# EAGLE design Main (EAGLE 7.5.0)
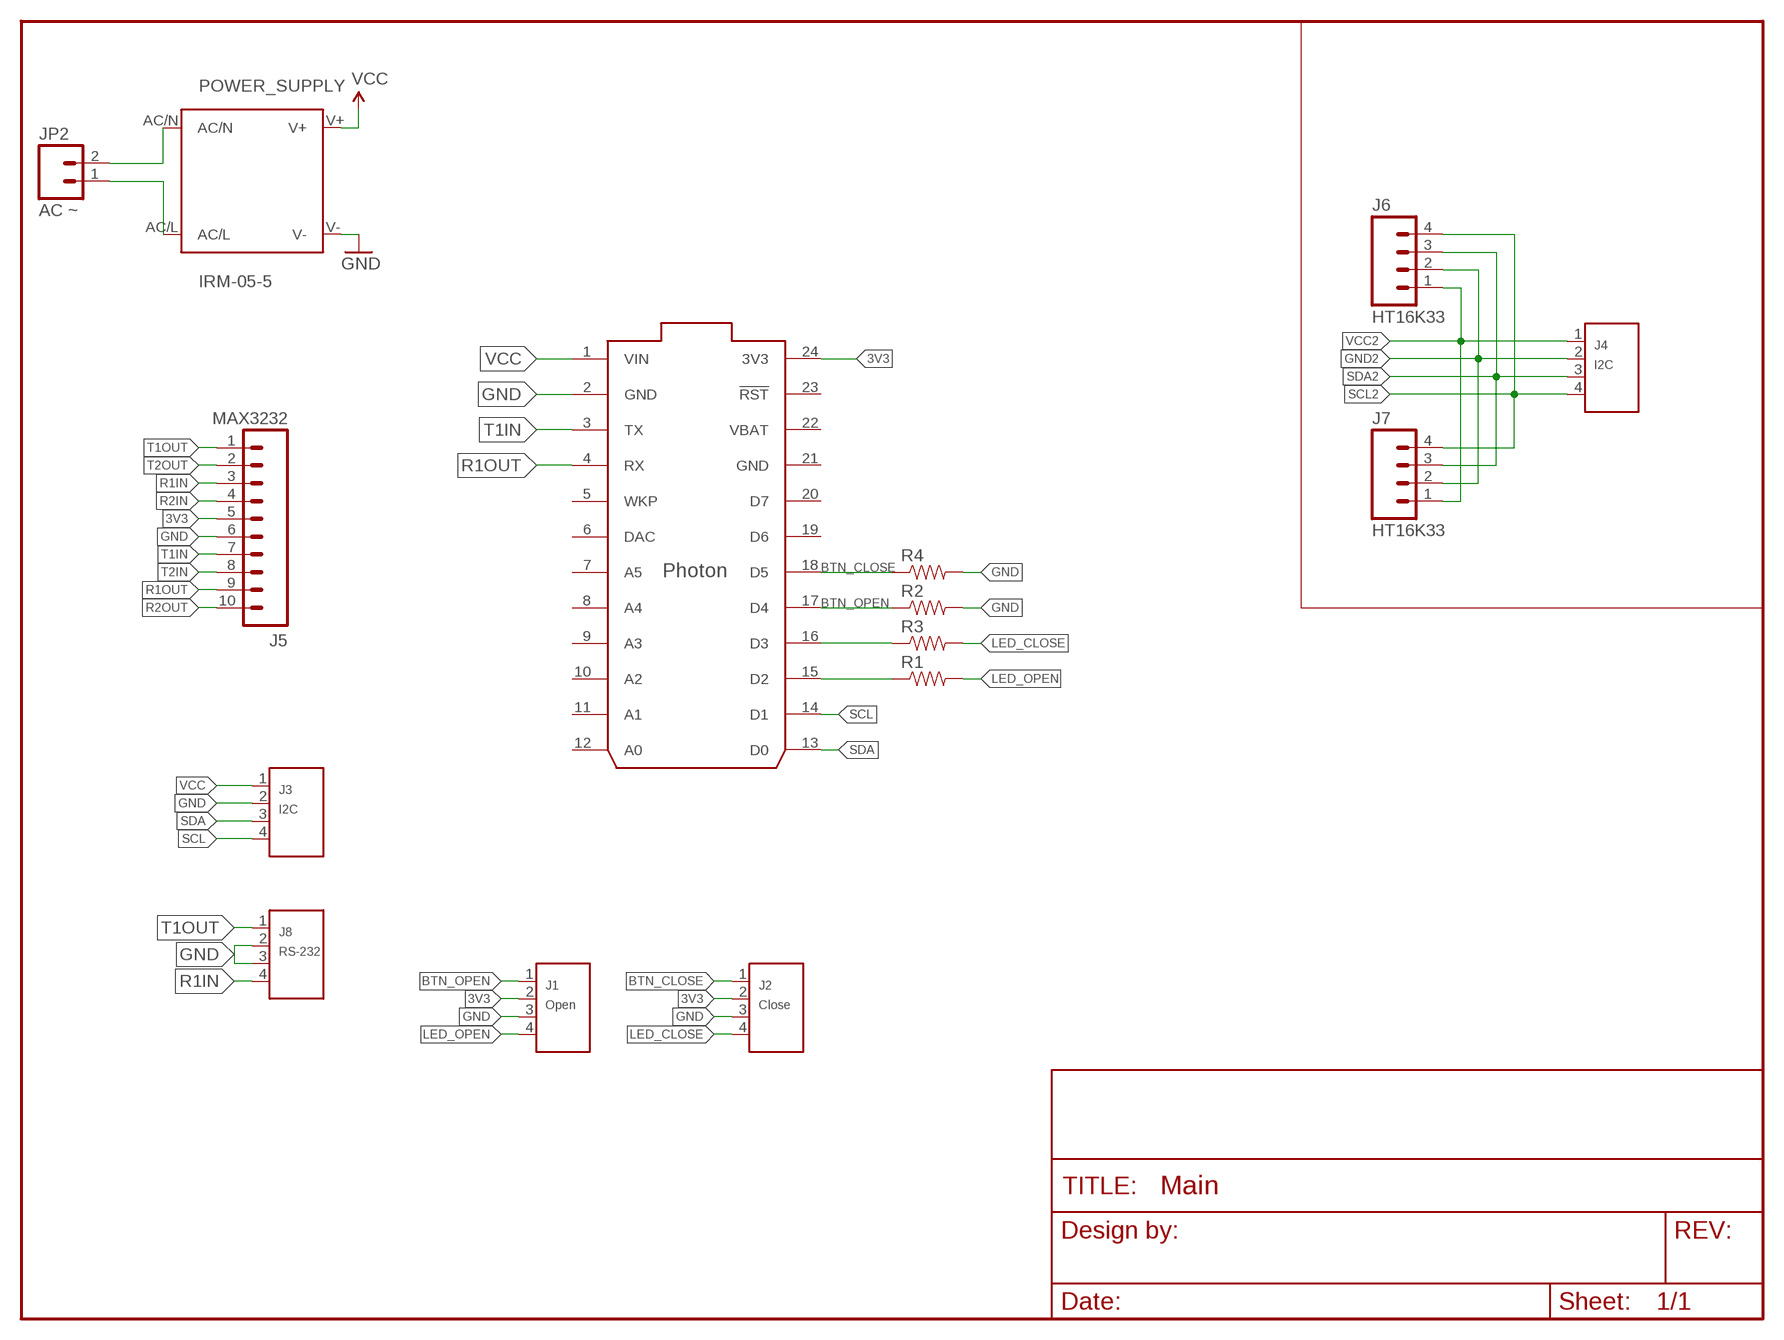
[diagram p0: schematic, sheet 1]

## Parts
J1  Open  GROVE-CONNECTOR-DIP(4P-2.0)  [HW4-2.0]
J2  Close  GROVE-CONNECTOR-DIP(4P-2.0)  [HW4-2.0]
J3  I2C  GROVE-CONNECTOR-DIP(4P-2.0)  [HW4-2.0]
J4  I2C  GROVE-CONNECTOR-DIP(4P-2.0)  [HW4-2.0]
J5  MAX3232  M10SILK_FEMALE_PTH  [1X10]
J6  HT16K33  M04PTH  [1X04]
J7  HT16K33  M04PTH  [1X04]
J8  RS-232  GROVE-CONNECTOR-DIP(4P-2.0)  [HW4-2.0]
JP2  AC ~  M025MM  [SCREWTERMINAL-5MM-2]
PHOTON  PHOTON  PHOTON_WITH_HEADERS  [PHOTON]
POWER_SUPPLY  IRM-05-5  IRM_05/10  [IRM_05/10]
R1  RESISTORPTH-1/4W  [AXIAL-0.4]
R2  RESISTORPTH-1/4W  [AXIAL-0.4]
R3  RESISTORPTH-1/4W  [AXIAL-0.4]
R4  RESISTORPTH-1/4W  [AXIAL-0.4]

## Nets
3V3: J1.2 J2.2 J5.5 PHOTON.24(3V3)
BTN_CLOSE: J2.1 PHOTON.18(D5) R4.P$1
BTN_OPEN: J1.1 PHOTON.17(D4) R2.P$1
GND: J1.3 J2.3 J3.2 J5.6 J8.2 J8.3 PHOTON.2(GND) POWER_SUPPLY.V- R2.P$2 R4.P$2
GND2: J4.2 J6.2 J7.2
LED_CLOSE: J2.4 R3.P$2
LED_OPEN: J1.4 R1.P$2
N$1: JP2.1 POWER_SUPPLY.AC/L
N$2: JP2.2 POWER_SUPPLY.AC/N
N$7: PHOTON.16(D3) R3.P$1
N$8: PHOTON.15(D2) R1.P$1
R1IN: J5.3 J8.4
R1OUT: J5.9 PHOTON.4(RX)
R2IN: J5.4
R2OUT: J5.10
SCL: J3.4 PHOTON.14(D1)
SCL2: J4.4 J6.4 J7.4
SDA: J3.3 PHOTON.13(D0)
SDA2: J4.3 J6.3 J7.3
T1IN: J5.7 PHOTON.3(TX)
T1OUT: J5.1 J8.1
T2IN: J5.8
T2OUT: J5.2
VCC: J3.1 PHOTON.1(VIN) POWER_SUPPLY.V+
VCC2: J4.1 J6.1 J7.1
Unconnected: PHOTON.5(WKP) PHOTON.6(DAC) PHOTON.7(A5) PHOTON.8(A4) PHOTON.9(A3) PHOTON.10(A2) PHOTON.11(A1) PHOTON.12(A0) PHOTON.19(D6) PHOTON.20(D7) PHOTON.23(!RST)

## Power pins joined to a net without a drawn wire
GND: PHOTON.21(GND)
VBAT: PHOTON.22(VBAT)

## Library data of the parts
J1-J4 J8 = Seeed-OPL-Connector:GROVE-CONNECTOR-DIP(4P-2.0): 320110033; VALUE: 4P-2.0
J5 = SparkFun-Connectors:M10: Header 10 Standard 10-pin 0.1" header. Use with straight break away headers (SKU : PRT-00116), right angle break away headers (PRT-00553), swiss pins (PRT-00743), machine pins (PRT-00117), and female headers (PRT-00115).; PROD_ID: CONN-11563
J6 J7 = SparkFun-Connectors:M04: Header 4 Standard 4-pin 0.1" header. Use with straight break away headers (SKU : PRT-00116), right angle break away headers (PRT-00553), swiss pins (PRT-00743), machine pins (PRT-00117), and female headers (PRT-00115). Molex polarized connector foot print use with SKU : PRT-08231 with associated crimp pins and housings. 1MM SMD Version SKU: PRT-10208; PROD_ID: CONN-09696
JP2 = SparkFun-Connectors:M02: Standard 2-pin 0.1" header. Use with - straight break away headers ( PRT-00116) - right angle break away headers (PRT-00553) - swiss pins (PRT-00743) - machine pins (PRT-00117) - female headers (PRT-00115) Molex polarized connector foot print use with: PRT-08233 with associated crimp pins and housings. 2.54_SCREWTERM for use with PRT-10571. 3.5mm Screw Terminal footprints for PRT-08084 5mm Screw Terminal footprints for use with PRT-08432; STOREFRONT_ID: PRT-08432
PHOTON = Spark:PHOTON
POWER_SUPPLY = meanwell_irm_v5:IRM_05/10: 5 or 10 watt housing & pin compatible IRM 05 Vout [V] Imax [A] Pmax [W] Eff [%] 3.3 1.25 4.125 68 5 1 5 71 12 0.42 5.04 75 15 0.33 4.95 75 24 0.23 5.52 77 IRM 10 Vout [V] Imax [A] Pmax [W] Eff [%] 3.3 2.5 8.25 74 5 2 10 77 12 0.85 10.2 82 15 0.67 10.05 82 24 0.42 10.08 82
R1-R4 = SparkFun-Passives:RESISTOR: Resistor Basic schematic elements and footprints for 0603, 1206, and PTH resistors.

## Board
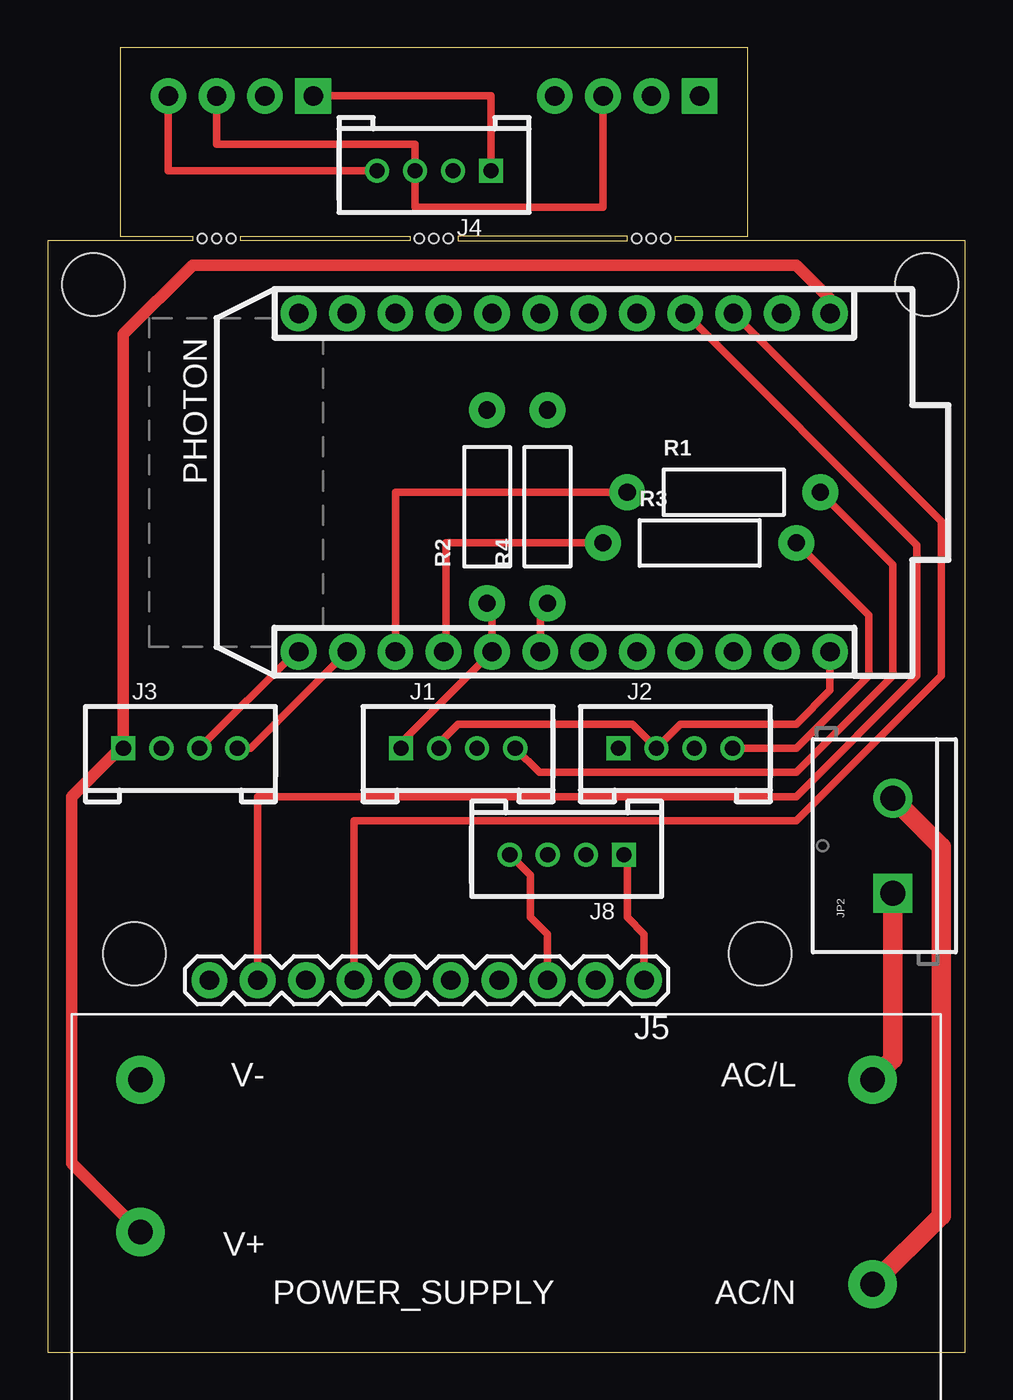
[diagram p1: board, top side]
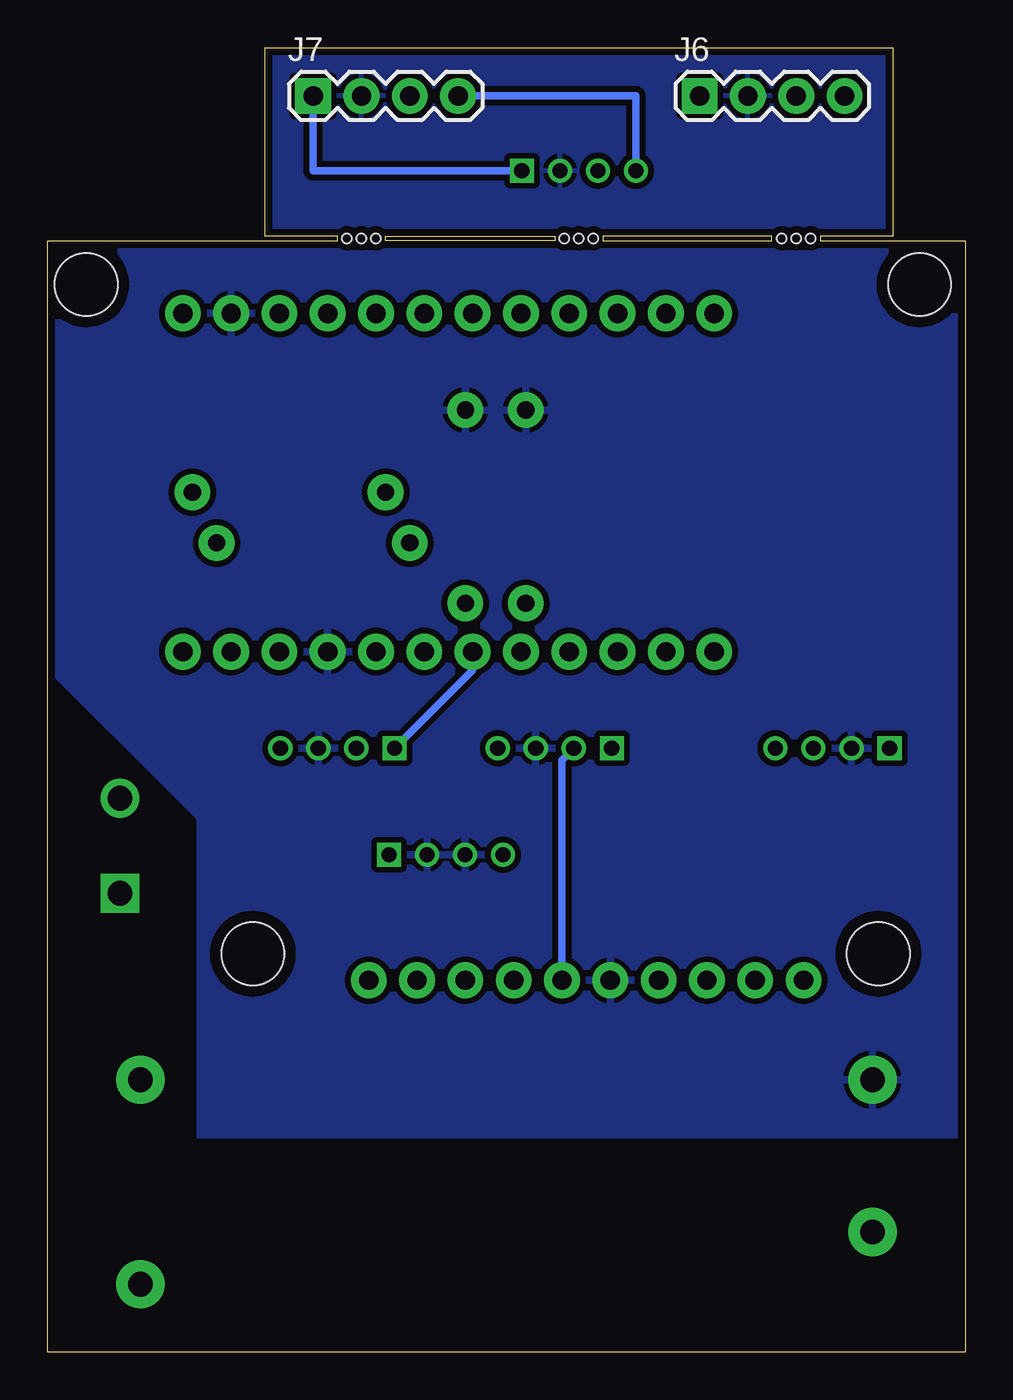
[diagram p2: board, bottom side, seen from below]

Size 48.26 x 68.58 mm. Coordinates in mm from the lower left corner, seen from the top.
Outline: 0,0 48.26,0 48.26,58.42 33.02,58.42 33.02,58.67 36.83,58.67 36.83,68.58 3.81,68.58 3.81,58.67 7.62,58.67 7.62,58.42 0,58.42 0,0
Outline: 10.16,58.67 19.05,58.67 19.05,58.42 10.16,58.42 10.16,58.67
Outline: 21.59,58.42 30.48,58.42 30.48,58.67 21.59,58.67 21.59,58.42
Copper layers (1*16): Top 0.0356mm / dielectric 1.5011mm / Bottom 0.0356mm
Design rules "oshpark-2layer": minimum track width 6mil, minimum drill 13mil, track to track 6mil, track to pad 6mil, pad to pad 6mil, via to via 6mil, smd to smd 6mil, copper to edge 15mil, drill to drill 6mil, minimum pad ring 7mil, minimum via ring 7mil, stop-mask expansion 2.5mil, vias tented up to drill 0mil, thermal gap 10mil
Holes 0.5 mm at 8.13,58.55 8.89,58.55 9.65,58.55 20.32,58.55 21.08,58.55 19.56,58.55 31.75,58.55 32.51,58.55 30.99,58.55

### Footprints (pad centres in the part's own frame; a part is rotated, then mirrored left to right if it is on the bottom)
HW4-2.0 = drill 0.8 pad 1.27 square: 1 -3,0 | drill 0.8 pad 1.27: 2 -1,0; 3 1,0; 4 3,0
1X10 = drill 1.016 pad 1.88: 1 0,0; 2 2.54,0; 3 5.08,0; 4 7.62,0; 5 10.16,0; 6 12.7,0; 7 15.24,0; 8 17.78,0; 9 20.32,0; 10 22.86,0
1X04 = drill 1.016 pad 1.88 square: 1 0,0 | drill 1.016 pad 1.88: 2 2.54,0; 3 5.08,0; 4 7.62,0
SCREWTERMINAL-5MM-2 = drill 1.3 pad 2.032 square: 1 0,0 | drill 1.3 pad 2.032: 2 5,0
PHOTON = drill 1.016 pad 1.88: 1 1.27,32.258; 2 1.27,29.718; 3 1.27,27.178; 4 1.27,24.638; 5 1.27,22.098; 6 1.27,19.558; 7 1.27,17.018; 8 1.27,14.478; 9 1.27,11.938; 10 1.27,9.398; 11 1.27,6.858; 12 1.27,4.318; 13 19.05,4.318; 14 19.05,6.858; 15 19.05,9.398; 16 19.05,11.938; 17 19.05,14.478; 18 19.05,17.018; 19 19.05,19.558; 20 19.05,22.098; 21 19.05,24.638; 22 19.05,27.178; 23 19.05,29.718; 24 19.05,32.258
IRM_05/10 = drill 1.3 pad 2.54: AC/L -19.25,-9.25; AC/N -19.25,1.5; V+ 19.25,-1.25; V- 19.25,-9.25
AXIAL-0.4 = drill 0.9 pad 1.88: P$1 -5.08,0; P$2 5.08,0
STAND-OFF = hole 3.302: 0,0

### Placement (x,y rotation side)
J1  21.59,31.75 0 top
J2  33.02,31.75 0 top
J3  6.99,31.75 0 top
J4  20.32,62.1 180 top
J5  31.37,19.56 180 top
J6  13.97,66.04 0 bottom
J7  34.29,66.04 0 bottom
J8  27.3,26.16 180 top
JP2  44.45,24.13 90 top
PHOTON  8.89,55.88 270 top
POWER_SUPPLY  24.13,5.08 180 top
R1  35.56,45.21 0 top
R2  23.11,44.45 90 top
R3  34.29,42.55 0 top
R4  26.29,44.45 90 top
U$3  [STAND-OFF]  37.47,20.95 90 top
U$4  [STAND-OFF]  46.23,56.13 0 top
U$5  [STAND-OFF]  4.57,20.95 0 top
U$6  [STAND-OFF]  2.41,56.13 0 top

### Tracks (layer width: path | path; a pad name or v marks a point on that pad's centre or on a via)
3V3
  Top 0.406: J1.2 20.59,32.02 21.59,33.02 30.75,33.02 J2.2 33.29,33.02 39.37,33.02 41.15,34.8 PHOTON.24
  Bottom 0.406: J5.5 21.21,31.13 J1.2
BTN_CLOSE
  Top 0.406: R4.P$1 25.91,39.37 PHOTON.18
  Bottom 0.406: J2.1 25.91,35.86 PHOTON.18
BTN_OPEN
  Top 0.406: J1.1 18.59,32.05 PHOTON.17 23.37,39.37 R2.P$1
GND
  pour Bottom (isolate 0.305): -1.27,58.42 49.53,58.42 49.53,11.43 -1.27,11.43
GND2
  pour Bottom (isolate 0.305, rank 2): 3.81,68.58 36.83,68.58 36.83,58.42 3.81,58.42
LED_CLOSE
  Top 0.406: R3.P$2 43.18,38.74 43.18,35.56 39.37,31.75 J2.4
LED_OPEN
  Top 0.406: R1.P$2 44.45,41.4 44.45,35.56 39.37,30.48 25.86,30.48 J1.4
N$1
  Top 1.016: JP2.1 44.45,15.4 POWER_SUPPLY.AC/L
N$2
  Top 1.016: JP2.2 46.99,26.59 46.99,7.19 POWER_SUPPLY.AC/N
N$3
  cutout Bottom: 49.53,36.83 40.64,27.94 40.64,-1.27 49.53,-1.27
N$7
  Top 0.254: 20.95,36.96 PHOTON.16
  Top 0.406: 20.95,36.96 20.95,42.55 R3.P$1
N$8
  Top 0.406: PHOTON.15 18.29,45.21 R1.P$1
R1IN
  Top 0.406: J5.3 26.29,21.97 25.4,22.86 25.4,25.07 J8.4
R1OUT
  Top 0.406: PHOTON.4 45.72,42.42 45.72,35.56 39.37,29.21 11.05,29.21 J5.9
SCL
  Top 0.406: 15.7,36.83 PHOTON.14 10.67,31.75 J3.4
SCL2
  Top 0.406: J6.4 6.35,62.1 J4.4
  Bottom 0.406: J4.4 17.32,66.04 J7.4
SDA
  Top 0.406: J3.3 13.06,36.83 PHOTON.13
SDA2
  Top 0.406: J6.3 8.89,63.5 19.32,63.5 J4.3 19.32,60.2 29.21,60.2 J7.3
T1IN
  Top 0.406: PHOTON.3 46.99,43.69 46.99,35.56 39.37,27.94 16.13,27.94 J5.7
T1OUT
  Top 0.406: J5.1 31.37,21.97 30.48,22.86 30.48,25.99 J8.1
VCC
  Top 0.61: POWER_SUPPLY.V+ 1.27,9.94 1.27,29.21 3.81,31.75 J3.1 3.98,53.52 7.62,57.15 39.37,57.15 41.15,55.37 PHOTON.1
VCC2
  Top 0.406: J6.1 23.32,66.04 J4.1
  Bottom 0.406: J7.1 34.29,62.1 J4.1